# EAGLE design IOTA-GFT-Shield-a (EAGLE 9.6.2)
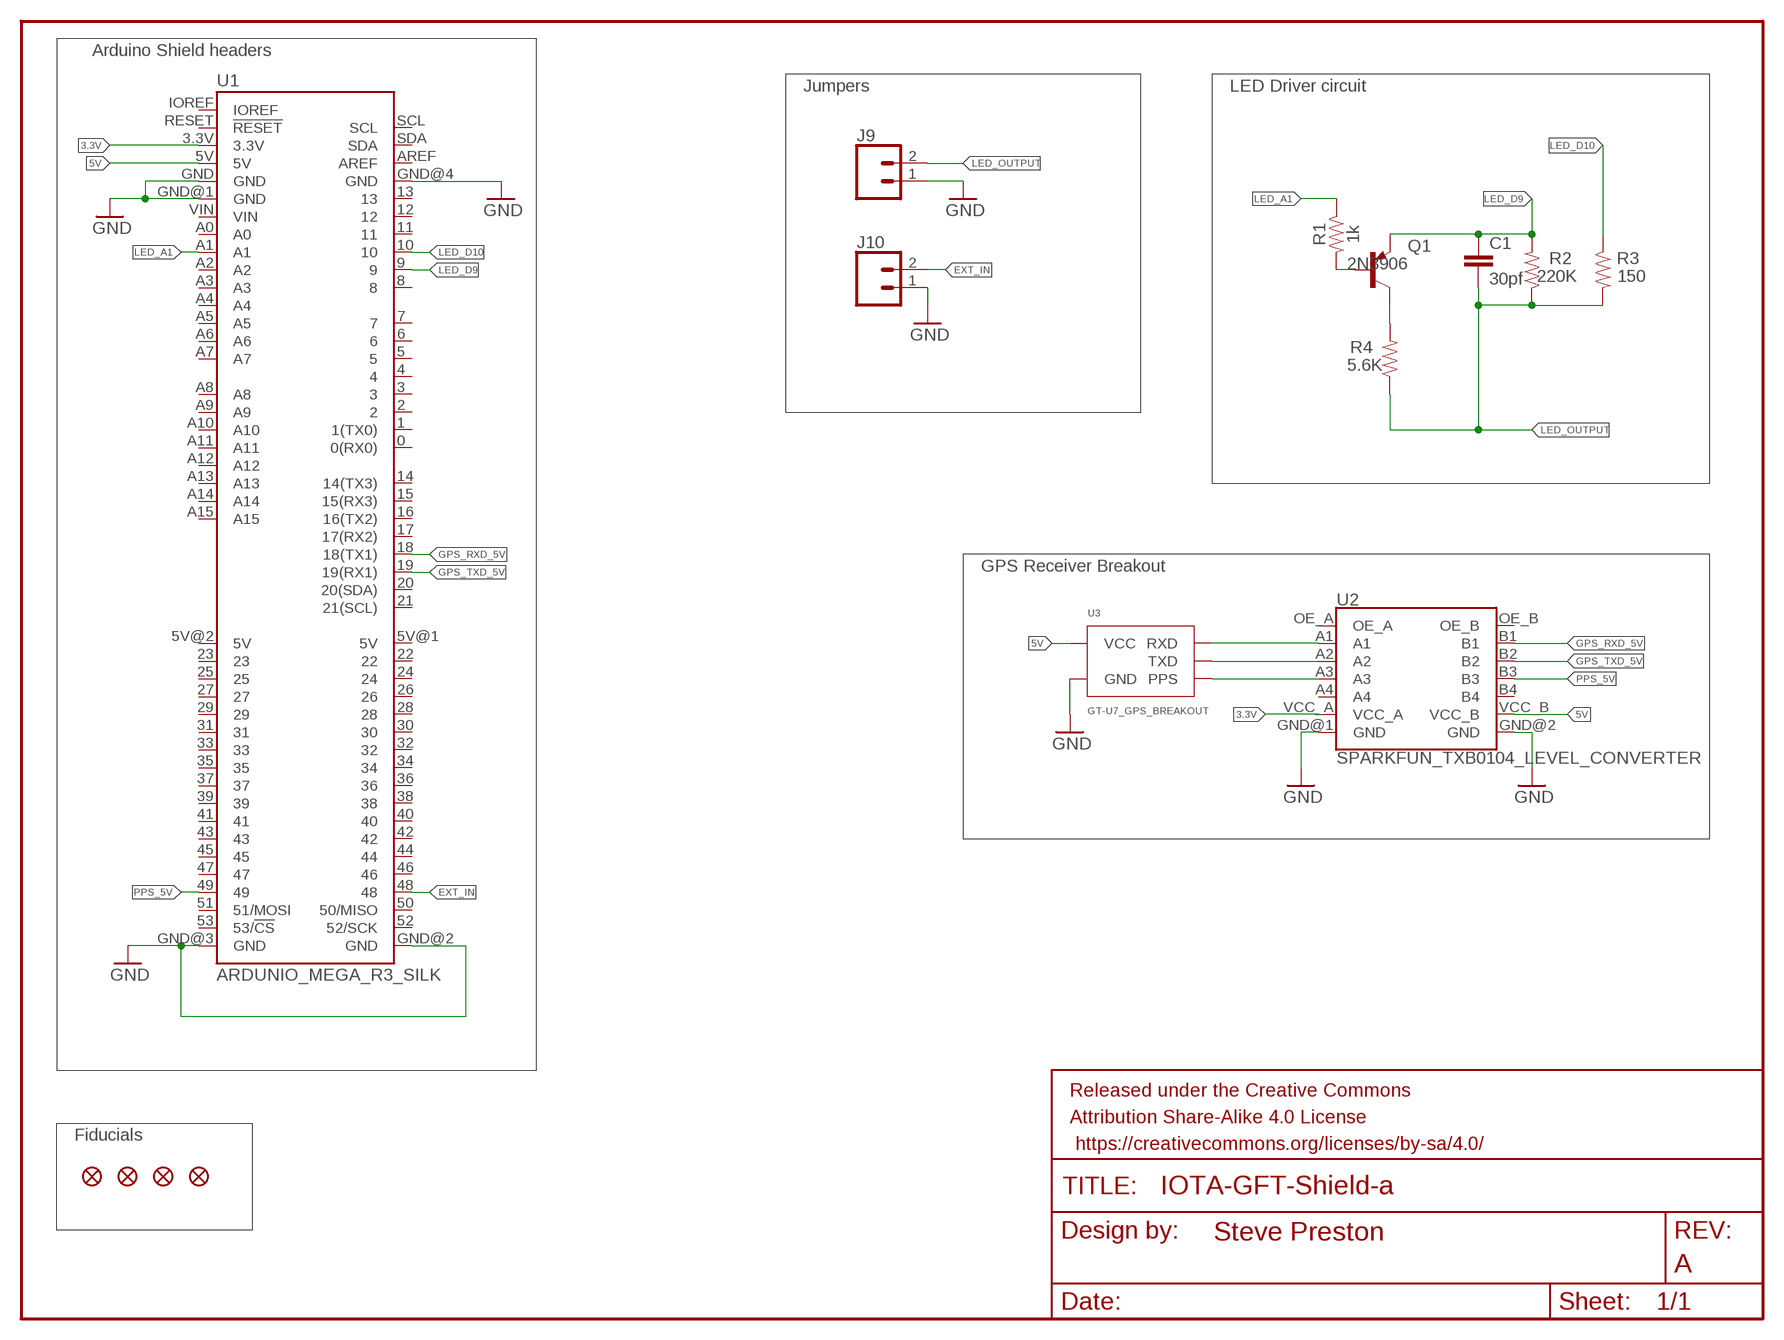
[diagram p0: schematic, sheet 1]

## Parts
C1  30pf  CAP-PTH  [CAP-PTH-5MM]
FD1  FIDUCIALUFIDUCIAL  [FIDUCIAL-MICRO]
FD2  FIDUCIALUFIDUCIAL  [FIDUCIAL-MICRO]
FD3  FIDUCIALUFIDUCIAL  [FIDUCIAL-MICRO]
FD4  FIDUCIALUFIDUCIAL  [FIDUCIAL-MICRO]
FRAME1  FRAME-LETTER  [CREATIVE_COMMONS]
J9  CONN_02  [1X02]
J10  CONN_02  [1X02]
Q1  2N3906  [TO92]
R1  1k  1KOHM-HORIZ-1/4W-1%  [AXIAL-0.3]
R2  220K  1KOHM-HORIZ-1/4W-1%  [AXIAL-0.3]
R3  150  1KOHM-HORIZ-1/4W-1%  [AXIAL-0.3]
R4  5.6K  RESISTORAXIAL-0.3  [AXIAL-0.3]
U1  ARDUNIO_MEGA_R3_SILK  [ARDUINO_MEGA_SILK]
U2  SPARKFUN_TXB0104_LEVEL_CONVERTER  [TXB0104_LEVEL_CONVERTER]
U3  GT-U7_GPS_BREAKOUT  [GT-UT]

## Nets
3.3V: U1.3.3V U2.VCC_A
5V: U1.5V U2.VCC_B U3.VCC
EXT_IN: J10.2 U1.48
GND: J9.1 J10.1 U1.GND U1.GND@1(GND) U1.GND@2(GND) U1.GND@3(GND) U1.GND@4(GND) U2.GND@1(GND) U2.GND@2(GND) U3.GND
GPS_RXD: U2.A1 U3.RXD
GPS_RXD_5V: U1.18(18(TX1)) U2.B1
GPS_TXD: U2.A2 U3.TXD
GPS_TXD_5V: U1.19(19(RX1)) U2.B2
LED_A1: R1.P$1 U1.A1
LED_D9: C1.1 Q1.3(E) R2.P$2 U1.9
LED_D10: R3.P$1 U1.10
LED_OUTPUT: C1.2 J9.2 R2.P$1 R3.P$2 R4.P$1
N$4: Q1.1(C) R4.P$2
N$6: Q1.2(B) R1.P$2
PPS: U2.A3 U3.PPS
PPS_5V: U1.49 U2.B3
Unconnected: U1.0(0(RX0)) U1.1(1(TX0)) U1.2 U1.3 U1.4 U1.5 U1.5V@1(5V) U1.5V@2(5V) U1.6 U1.7 U1.8 U1.11 U1.12 U1.13 U1.14(14(TX3)) U1.15(15(RX3)) U1.16(16(TX2)) U1.17(17(RX2)) U1.20(20(SDA)) U1.21(21(SCL)) U1.22 U1.23 U1.24 U1.25 U1.26 U1.27 U1.28 U1.29 U1.30 U1.31 U1.32 U1.33 U1.34 U1.35 U1.36 U1.37 U1.38 U1.39 U1.40 U1.41 U1.42 U1.43 U1.44 U1.45 U1.46 U1.47 U1.50(50/MISO) U1.51(51/MOSI) U1.52(52/SCK) U1.53(53/!CS) U1.A0 U1.A2 U1.A3 U1.A4 U1.A5 U1.A6 U1.A7 U1.A8 U1.A9 U1.A10 U1.A11 U1.A12 U1.A13 U1.A14 U1.A15 U1.AREF U1.IOREF U1.RESET(!RESET) U1.SCL U1.SDA U1.VIN U2.A4 U2.B4 U2.OE_A U2.OE_B

## Notes on the sheet
- Arduino Shield headers
- Jumpers | LED Driver circuit
- GPS Receiver Breakout
- Fiducials

## Library data of the parts
C1 = sbp_misc:CAP-PTH: Generic Capacitor for PTH
FD1-FD4 = SparkFun-Aesthetics:FIDUCIAL: Fiducial Alignment Points Point-of-reference for pick-and-place machines and other optical instruments.
FRAME1 = SparkFun-Aesthetics:FRAME-LETTER: Schematic Frame - Letter Standard 8.5x11 US Letter frame; DESIGNER: Steve Preston; REV: A
J9 J10 = SparkFun-Connectors:CONN_02: Multi connection point. Often used as Generic Header-pin footprint for 0.1 inch spaced/style header connections On any of the 0.1 inch spaced packages, you can populate with these: Break Away Headers - Straight <https://www.sparkfun.com/products/116> (PRT-00116) Break Away Male Headers - Right Angle <https://www.sparkfun.com/products/553> (PRT-00553) Female Headers <https://www.sparkfun.com/products/115> (PRT-00115) Break Away Headers - Machine Pin <https://www.sparkfun.com/products/117> (PRT-00117) Break Away Female Headers - Swiss Machine Pin <https://www.sparkfun.com/products/743> (PRT-00743) For SCREWTERMINALS and SPRING TERMINALS visit here: Screw Terimnals on SparkFun.com <https://www.sparkfun.com/search/results?term=Screw+Terminals> (5mm/3.5mm/2.54mm spacing) This device is also useful as a general connection point to wire up your design to another part of your project. Our various solder wires solder well into these plated through hole pads. Hook-Up Wire - Assortment (Stranded, 22 AWG) <https://www.sparkfun.com/products/11375> (PRT-11375) Hook-Up Wire - Assortment (Solid Core, 22 AWG) <https://www.sparkfun.com/products/11367> (PRT-11367) View the entire wire category on our website here <https://www.sparkfun.com/categories/141> Special notes: Molex polarized connector foot print use with: PRT-08233 with associated crimp pins and housings. 2.54_SCREWTERM for use with PRT-10571. 3.5mm Screw Terminal footprints for PRT-08084 5mm Screw Terminal footprints for use with PRT-08432
Q1 = transistor-pnp:2N3906: PNP Transistor
R1 = SparkFun-Resistors:1KOHM: 1kΩ resistor A resistor is a passive two-terminal electrical component that implements electrical resistance as a circuit element. Resistors act to reduce current flow, and, at the same time, act to lower voltage levels within circuits. - Wikipedia; PROD_ID: RES-12182
R2 R3 = SparkFun-Resistors:1KOHM: 1kΩ resistor A resistor is a passive two-terminal electrical component that implements electrical resistance as a circuit element. Resistors act to reduce current flow, and, at the same time, act to lower voltage levels within circuits. - Wikipedia; PROD_ID: RES-12182; VALUE: 1k
R4 = SparkFun-Resistors:RESISTOR: Generic Resistor Package
U1 = sbp_misc:ARDUNIO_MEGA_R3_SILK: Arduino Mega R3 layout with Silk
U2 = sbp_misc:SPARKFUN_TXB0104_LEVEL_CONVERTER: SparkFun TXB0104 Logic Level Converter -Bi-Directional This is the mechnical outline for the TXB0104 bi directional logic level converter. This 4-bit noninverting translator uses two separate configurable power-supply rails. The A port is designed to track VCCA. VCCA accepts any supply voltage from 1.2V to 3.6V. The B port is designed to track VCCB. VCCB accepts any supply voltage from 1.65V to 5.5V. This allows for universal low-voltage bidirectional translation between any of the 1.2-V, 1.5-V, 1.8-V, 2.5-V, 3.3-V, and 5-V voltage nodes. VCCA should not exceed VCCB. SparkFun Products: SparkFun Logic Level Converter - Bi-Directional <https://www.sparkfun.com/products/11771>
U3 = sbp_misc:GT-U7_GPS_BREAKOUT: GT-UT GPS Breakout Board

## Board
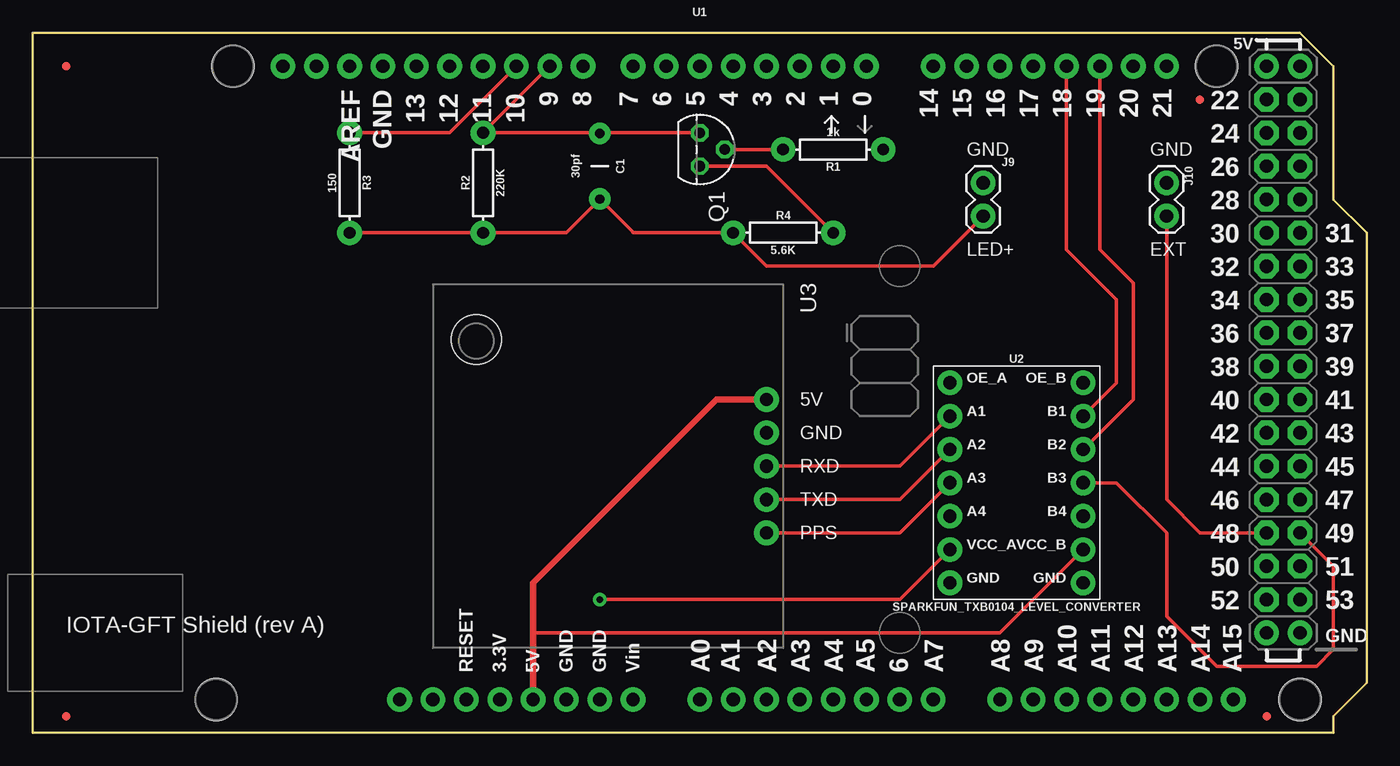
[diagram p1: board, top side]
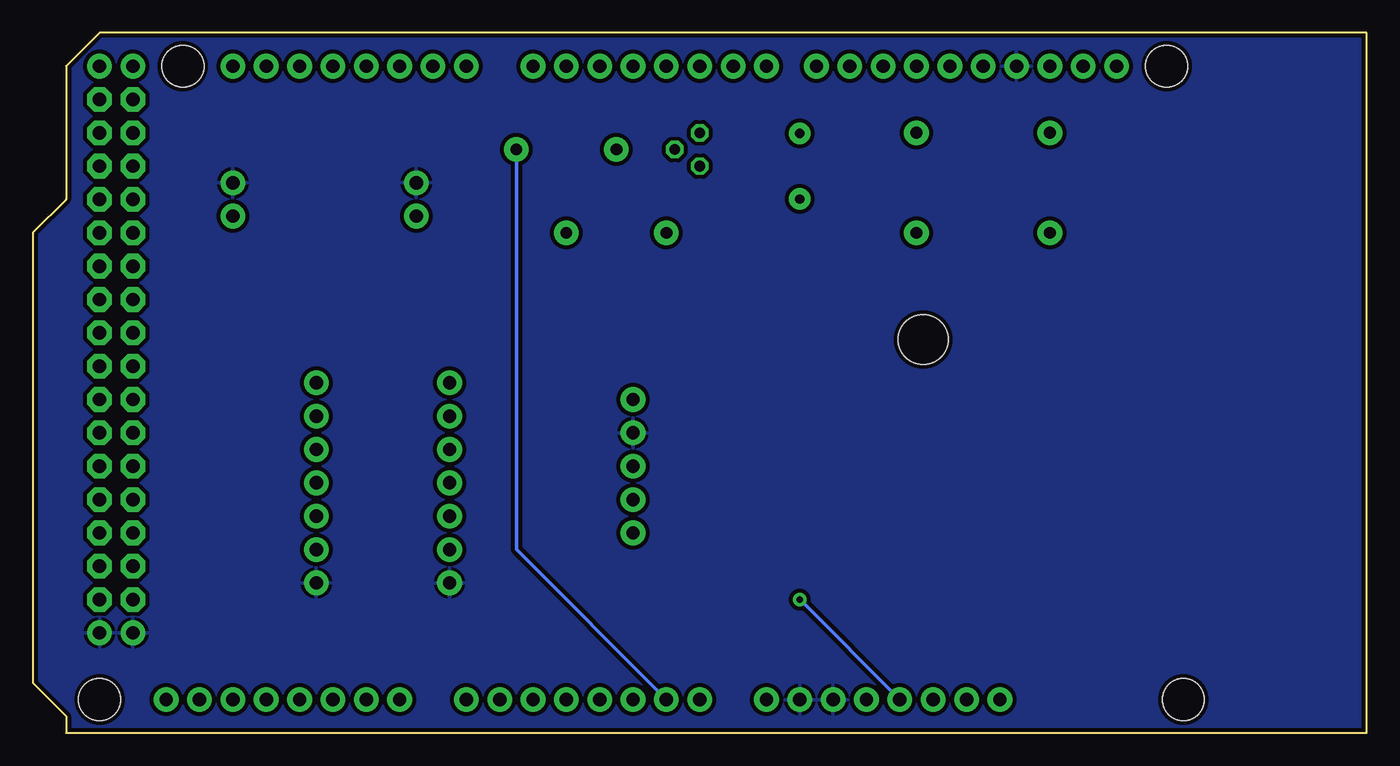
[diagram p2: board, bottom side, seen from below]

Size 101.6 x 53.34 mm. Coordinates in mm from the lower left corner, seen from the top.
Outline: 0,0 0,53.34 96.52,53.34 99.06,50.8 99.06,40.64 101.6,38.1 101.6,3.81 99.06,1.27 99.06,0 0,0
Copper layers (1*16): Top 0.035mm / dielectric 1.5mm / Bottom 0.035mm
Design rules "SparkFun-2-layer-STANDARD": minimum track width 10mil, minimum drill 20mil, track to track 10mil, track to pad 8mil, pad to pad 8mil, via to via 10mil, smd to smd 8mil, copper to edge 8mil, drill to drill 8mil, minimum pad ring 10mil, minimum via ring 10mil, stop-mask expansion 4mil, vias tented up to drill 25mil, thermal gap 10mil
Holes 3.2 mm at 90.17,50.8 96.52,2.54 15.24,50.8 13.97,2.54
Holes 3.81 mm at 33.78,29.97

### Footprints (pad centres in the part's own frame; a part is rotated, then mirrored left to right if it is on the bottom)
CAP-PTH-5MM = drill 0.7 pad 1.651: 1 -2.5,0; 2 2.5,0
FIDUCIAL-MICRO = smd 0.635 x 0.635: 1 0,0
1X02 = drill 1.016 pad 1.88: 1 0,0; 2 2.54,0
TO92 = drill 0.813 octagon: 1 1.27,0; 2 0,1.905; 3 -1.27,0
AXIAL-0.3 = drill 0.9 pad 1.88: P$1 -3.81,0; P$2 3.81,0
ARDUINO_MEGA_SILK = drill 1.016 pad 1.88: 0 13.97,24.13; 1 11.43,24.13; 2 8.89,24.13; 3 6.35,24.13; 3.3V -13.97,-24.13; 4 3.81,24.13; 5 1.27,24.13; 5V -11.43,-24.13; 5V@1 44.45,24.13; 5V@2 46.99,24.13; 6 -1.27,24.13; 7 -3.81,24.13; 8 -7.62,24.13; 9 -10.16,24.13; 10 -12.7,24.13; 11 -15.24,24.13; 12 -17.78,24.13; 13 -20.32,24.13; 14 19.05,24.13; 15 21.59,24.13; 16 24.13,24.13; 17 26.67,24.13; 18 29.21,24.13; 19 31.75,24.13; 20 34.29,24.13; 21 36.83,24.13; A0 1.27,-24.13; A1 3.81,-24.13; A2 6.35,-24.13; A3 8.89,-24.13; A4 11.43,-24.13; A5 13.97,-24.13; A6 16.51,-24.13; A7 19.05,-24.13; A8 24.13,-24.13; A9 26.67,-24.13; A10 29.21,-24.13; A11 31.75,-24.13; A12 34.29,-24.13; A13 36.83,-24.13; A14 39.37,-24.13; A15 41.91,-24.13; AREF -25.4,24.13; GND -8.89,-24.13; GND@1 -6.35,-24.13; GND@2 44.45,-19.05; GND@3 46.99,-19.05; GND@4 -22.86,24.13; IOREF -19.05,-24.13; NC -21.59,-24.13; RESET -16.51,-24.13; SCL -30.48,24.13; SDA -27.94,24.13; VIN -3.81,-24.13 | drill 1.016 pad 1.88 octagon: 22 44.45,21.59; 23 46.99,21.59; 24 44.45,19.05; 25 46.99,19.05; 26 44.45,16.51; 27 46.99,16.51; 28 44.45,13.97; 29 46.99,13.97; 30 44.45,11.43; 31 46.99,11.43; 32 44.45,8.89; 33 46.99,8.89; 34 44.45,6.35; 35 46.99,6.35; 36 44.45,3.81; 37 46.99,3.81; 38 44.45,1.27; 39 46.99,1.27; 40 44.45,-1.27; 41 46.99,-1.27; 42 44.45,-3.81; 43 46.99,-3.81; 44 44.45,-6.35; 45 46.99,-6.35; 46 44.45,-8.89; 47 46.99,-8.89; 48 44.45,-11.43; 49 46.99,-11.43; 50 44.45,-13.97; 51 46.99,-13.97; 52 44.45,-16.51; 53 46.99,-16.51
TXB0104_LEVEL_CONVERTER = drill 1.016 pad 1.88: A1 -5.08,3.81; A2 -5.08,1.27; A3 -5.08,-1.27; A4 -5.08,-3.81; B1 5.08,3.81; B2 5.08,1.27; B3 5.08,-1.27; B4 5.08,-3.81; GND@1 -5.08,-8.89; GND@2 5.08,-8.89; OE_A -5.08,6.35; OE_B 5.08,6.35; VCC_A -5.08,-6.35; VCC_B 5.08,-6.35
GT-UT = drill 1.016 pad 1.88: GND -2.54,0; PPS 5.08,0; RXD 0,0; TXD 2.54,0; VCC -5.08,0

### Placement (x,y rotation side)
C1  43.18,43.18 270 top
FD1  2.54,50.8 0 top
FD2  2.54,1.27 0 top
FD3  93.98,1.27 0 top
FD4  88.9,48.26 0 top
FRAME1  25.4,-10.16 0 top  (outside the outline)
J9  72.39,41.91 270 top
J10  86.36,41.91 270 top
Q1  50.8,44.45 270 top
R1  60.96,44.45 180 top
R2  34.29,41.91 90 top
R3  24.13,41.91 270 top
R4  57.15,38.1 0 top
U1  49.53,26.67 0 top
U2  74.93,20.32 0 top
U3  55.88,20.32 270 top

### Tracks (layer width: path | path; a pad name or v marks a point on that pad's centre or on a via)
3.3V  (via drill 0.51)
  Top 0.254: v43.18,10.16 66.04,10.16 U2.VCC_A
  Bottom 0.254: U1.3.3V v43.18,10.16
5V
  Top 0.254: U2.VCC_B 73.66,7.62 38.1,7.62
  Top 0.508: U1.5V 38.1,7.62 38.1,11.43 52.07,25.4 U3.VCC
EXT_IN
  Top 0.254: J10.2 86.36,17.78 88.9,15.24 U1.48
GND
  pour Bottom (isolate 0.305): 0,53.34 96.52,53.34 99.06,50.8 99.06,40.64 101.6,38.1 101.6,3.81 99.06,1.27 99.06,0 0,0
GPS_RXD
  Top 0.254: U3.RXD 66.04,20.32 U2.A1
GPS_RXD_5V
  Top 0.254: U2.B1 82.55,26.67 82.55,33.02 78.74,36.83 U1.18
GPS_TXD
  Top 0.254: U2.A2 66.04,17.78 U3.TXD
GPS_TXD_5V
  Top 0.254: U2.B2 83.82,25.4 83.82,34.29 81.28,36.83 U1.19
LED_A1
  Bottom 0.254: U1.A1 64.77,13.97 R1.P$1
LED_D9
  Top 0.254: U1.9 R2.P$2 43.14,45.72 C1.1 43.22,45.72 Q1.3
LED_D10
  Top 0.254: R3.P$1 31.75,45.72 U1.10
LED_OUTPUT
  Top 0.254: R3.P$2 R2.P$1 40.64,38.1 43.2,40.66 | C1.2 43.2,40.66 | 43.2,40.66 45.72,38.14 45.72,38.1 R4.P$1 55.88,35.56 68.58,35.56 J9.2
N$4
  Top 0.254: Q1.1 55.88,43.18 R4.P$2
N$6
  Top 0.254: Q1.2 R1.P$2
PPS
  Top 0.254: U2.A3 66.04,15.24 U3.PPS
PPS_5V
  Top 0.254: U1.49 99.06,12.7 99.06,6.35 97.79,5.08 90.17,5.08 86.36,8.89 86.36,15.24 82.55,19.05 U2.B3

### Text on the board
tPlace: GND | GND | LED+ | EXT | 5V | GND | RXD | TXD | PPS | IOTA-GFT Shield (rev A)